# EAGLE design eLite Clock - Alpha Board (EAGLE 9.6.0)
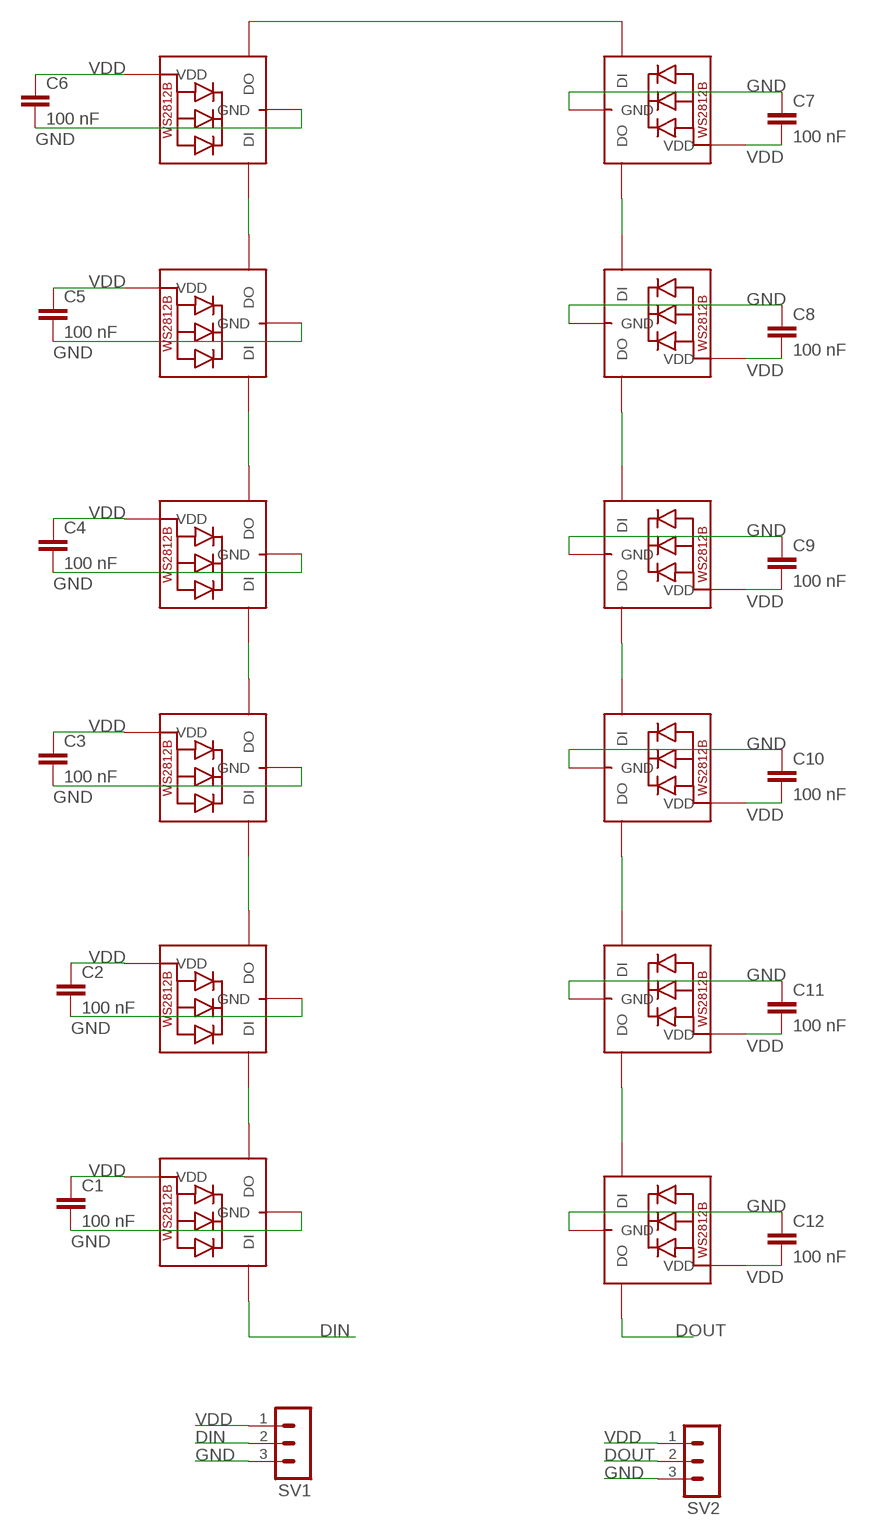
[diagram p0: schematic, sheet 1]

## Parts
C1  100 nF  C-EU025-025X050  [C025-025X050]
C2  100 nF  C-EU025-025X050  [C025-025X050]
C3  100 nF  C-EU025-025X050  [C025-025X050]
C4  100 nF  C-EU025-025X050  [C025-025X050]
C5  100 nF  C-EU025-025X050  [C025-025X050]
C6  100 nF  C-EU025-025X050  [C025-025X050]
C7  100 nF  C-EU025-025X050  [C025-025X050]
C8  100 nF  C-EU025-025X050  [C025-025X050]
C9  100 nF  C-EU025-025X050  [C025-025X050]
C10  100 nF  C-EU025-025X050  [C025-025X050]
C11  100 nF  C-EU025-025X050  [C025-025X050]
C12  100 nF  C-EU025-025X050  [C025-025X050]
LED1  WS2812B_5050W  [WS2812B-WIDE]
LED2  WS2812B_5050W  [WS2812B-WIDE]
LED3  WS2812B_5050W  [WS2812B-WIDE]
LED4  WS2812B_5050W  [WS2812B-WIDE]
LED5  WS2812B_5050W  [WS2812B-WIDE]
LED6  WS2812B_5050W  [WS2812B-WIDE]
LED7  WS2812B_5050W  [WS2812B-WIDE]
LED8  WS2812B_5050W  [WS2812B-WIDE]
LED9  WS2812B_5050W  [WS2812B-WIDE]
LED10  WS2812B_5050W  [WS2812B-WIDE]
LED11  WS2812B_5050W  [WS2812B-WIDE]
LED12  WS2812B_5050W  [WS2812B-WIDE]
SV1  MA03-1  [MA03-1]
SV2  MA03-1  [MA03-1]

## Nets
DIN: LED1.4-DIN(DI) SV1.2
DOUT: LED12.2-DOUT(DO) SV2.2
GND: C1.2 C2.2 C3.2 C4.2 C5.2 C6.2 C7.1 C8.1 C9.1 C10.1 C11.1 C12.1 LED1.3-GND(GND) LED2.3-GND(GND) LED3.3-GND(GND) LED4.3-GND(GND) LED5.3-GND(GND) LED6.3-GND(GND) LED7.3-GND(GND) LED8.3-GND(GND) LED9.3-GND(GND) LED10.3-GND(GND) LED11.3-GND(GND) LED12.3-GND(GND) SV1.3 SV2.3
N$1: LED1.2-DOUT(DO) LED2.4-DIN(DI)
N$2: LED2.2-DOUT(DO) LED3.4-DIN(DI)
N$3: LED3.2-DOUT(DO) LED4.4-DIN(DI)
N$4: LED4.2-DOUT(DO) LED5.4-DIN(DI)
N$5: LED5.2-DOUT(DO) LED6.4-DIN(DI)
N$6: LED6.2-DOUT(DO) LED7.4-DIN(DI)
N$14: LED7.2-DOUT(DO) LED8.4-DIN(DI)
N$15: LED8.2-DOUT(DO) LED9.4-DIN(DI)
N$16: LED9.2-DOUT(DO) LED10.4-DIN(DI)
N$17: LED10.2-DOUT(DO) LED11.4-DIN(DI)
N$18: LED11.2-DOUT(DO) LED12.4-DIN(DI)
VDD: C1.1 C2.1 C3.1 C4.1 C5.1 C6.1 C7.2 C8.2 C9.2 C10.2 C11.2 C12.2 LED1.1-VDD(VDD) LED2.1-VDD(VDD) LED3.1-VDD(VDD) LED4.1-VDD(VDD) LED5.1-VDD(VDD) LED6.1-VDD(VDD) LED7.1-VDD(VDD) LED8.1-VDD(VDD) LED9.1-VDD(VDD) LED10.1-VDD(VDD) LED11.1-VDD(VDD) LED12.1-VDD(VDD) SV1.1 SV2.1

## Library data of the parts
C1-C12 = rcl:C-EU: CAPACITOR, European symbol; SPICEPREFIX: C
LED1-LED12 = WS2812B-WIDE:WS2812B
SV1 SV2 = con-lstb:MA03-1: PIN HEADER; OC_FARNELL: unknown; OC_NEWARK: unknown

## Board
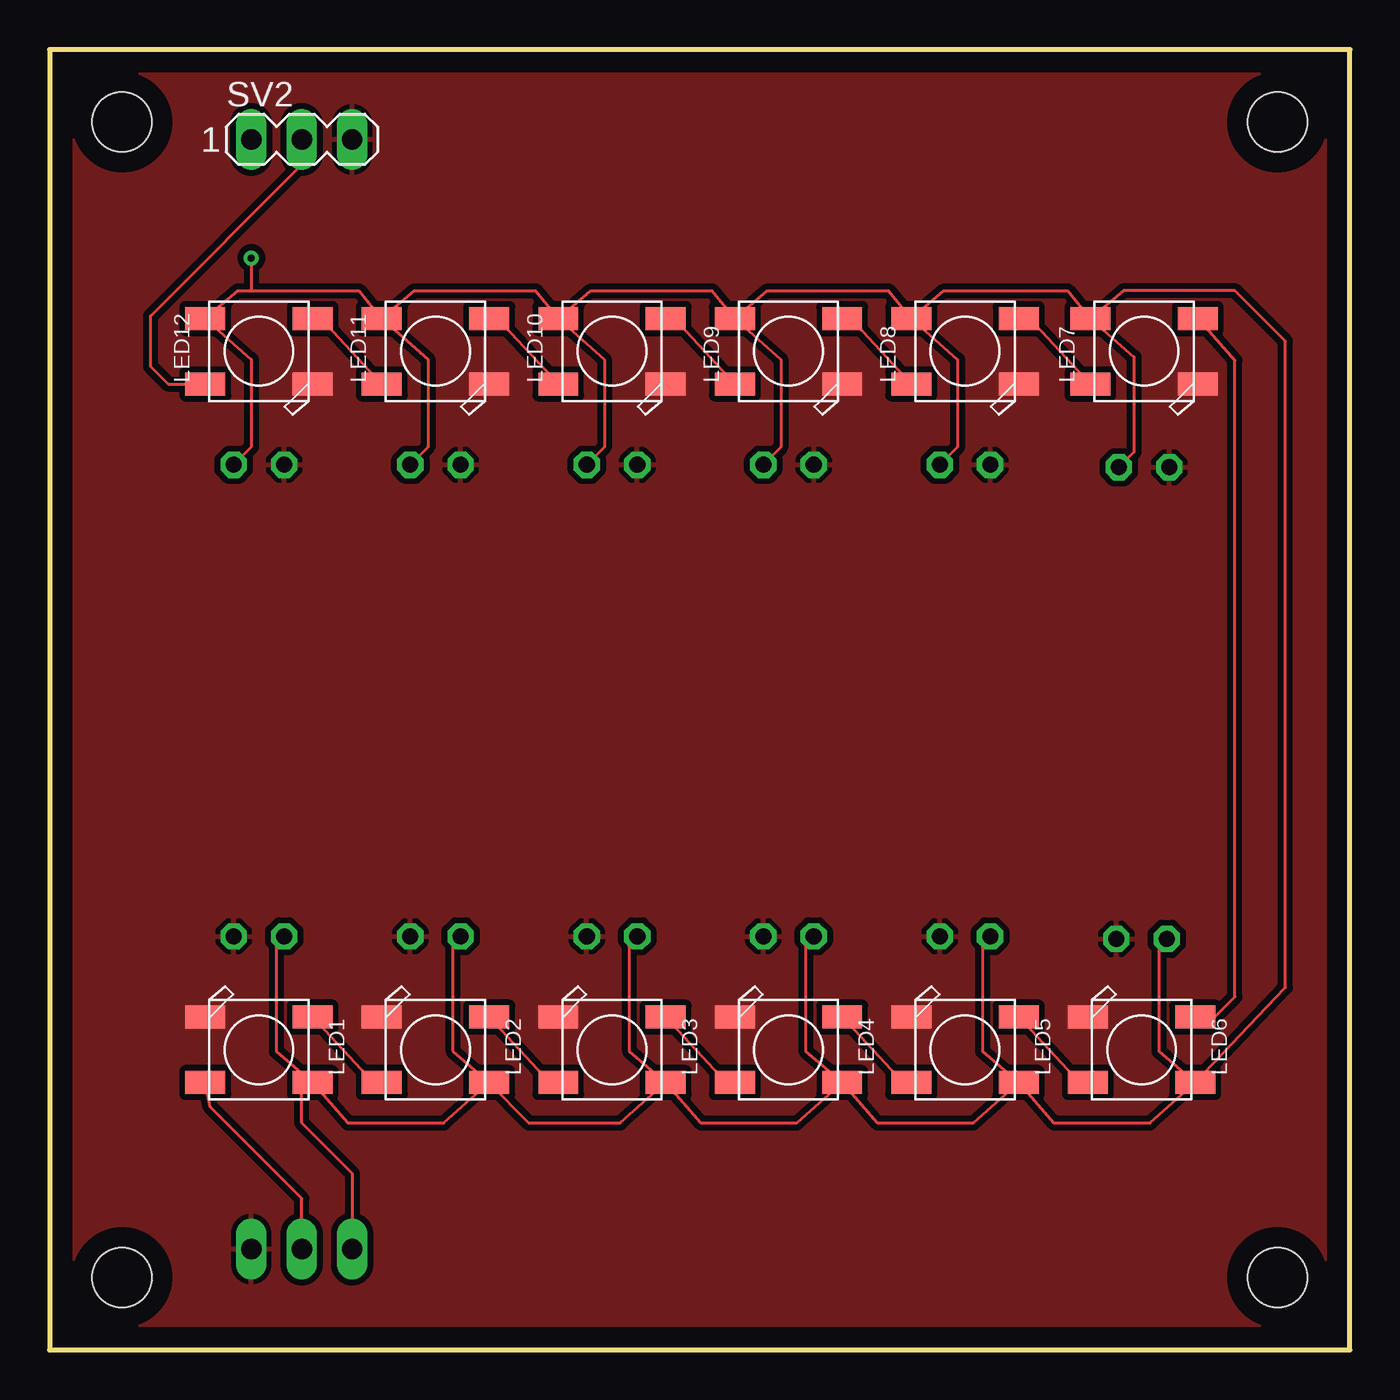
[diagram p1: board, top side]
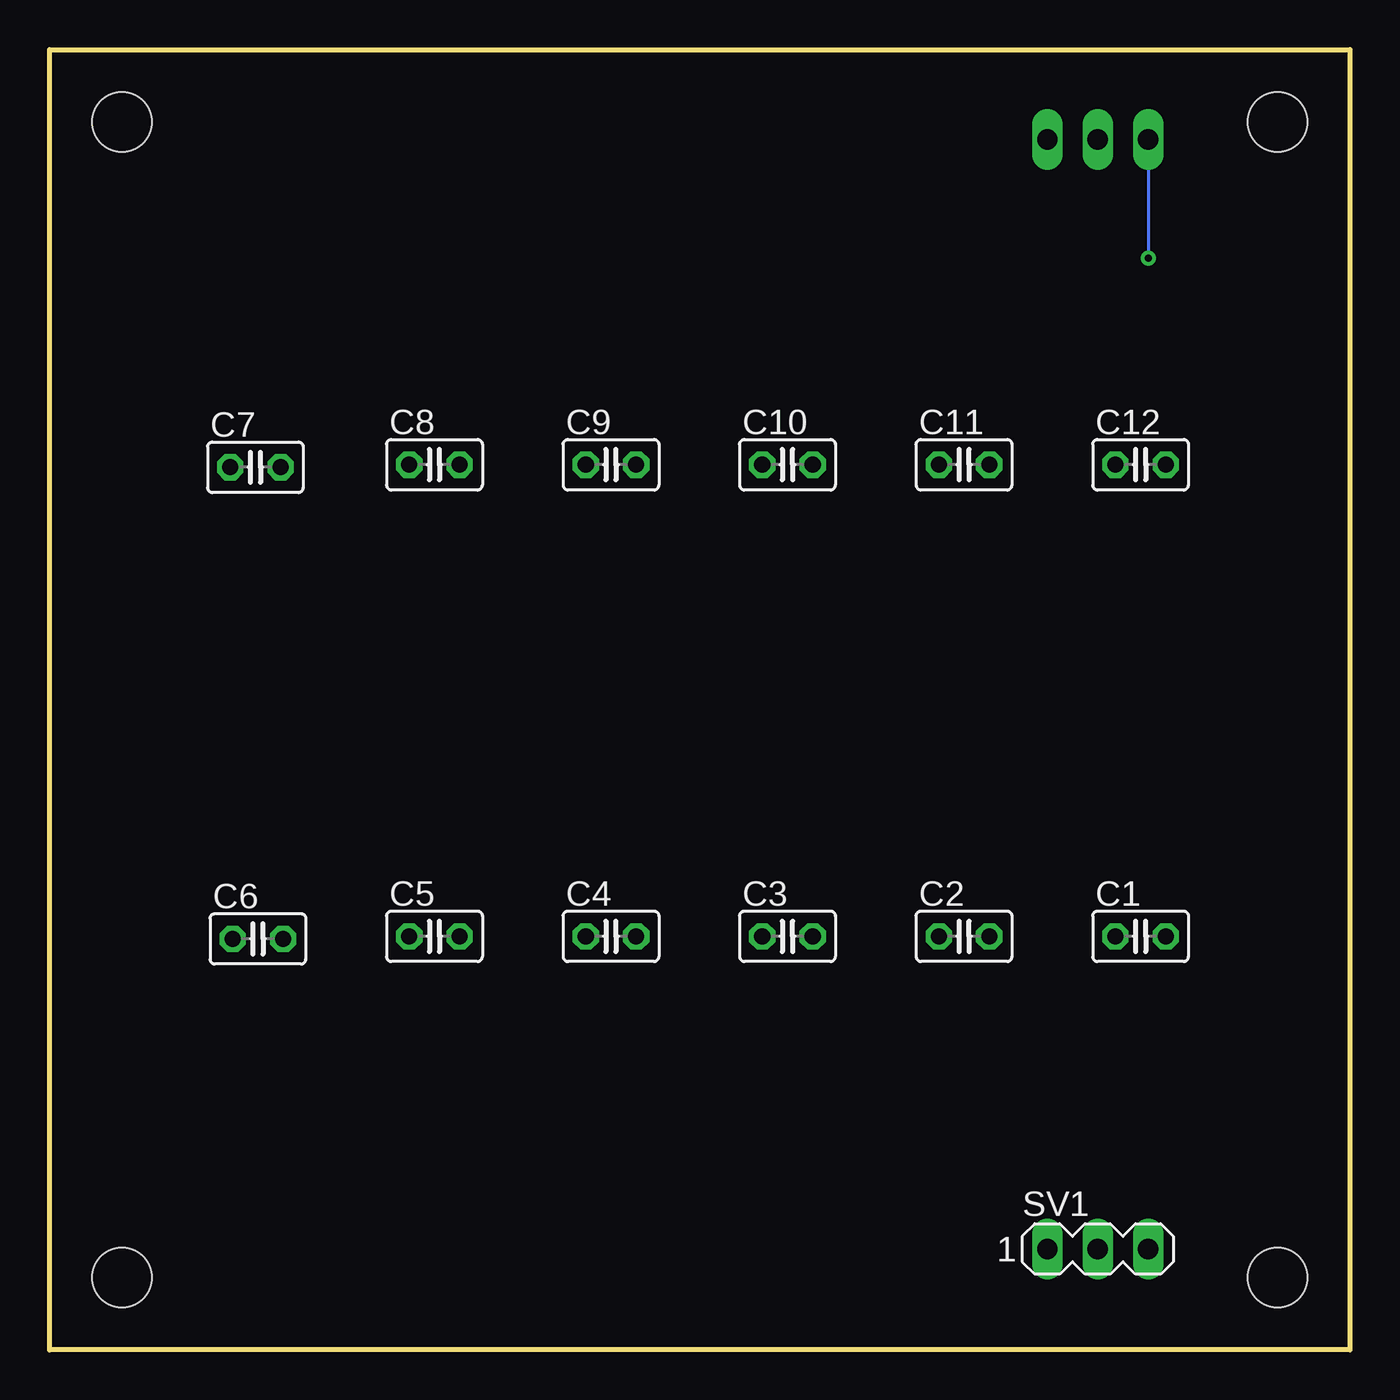
[diagram p2: board, bottom side, seen from below]

Size 65.48 x 65.48 mm. Coordinates in mm from the lower left corner, seen from the top.
Outline: 0,0 65.48,0 65.48,65.48 0,65.48 0,0
Copper layers (1*16): Top 0.035mm / dielectric 1.5mm / Bottom 0.035mm
Design rules "default": minimum track width 6mil, minimum drill 0.35mm, track to track 6mil, track to pad 6mil, pad to pad 6mil, via to via 6mil, smd to smd 6mil, copper to edge 40mil, drill to drill 6mil, minimum pad ring 10mil, minimum via ring 8mil, stop-mask expansion 4mil, vias tented up to drill 0mil, thermal gap 10mil
Holes 3 mm at 3.65,3.65 3.65,61.83 61.83,3.65 61.83,61.83

### Footprints (pad centres in the part's own frame; a part is rotated, then mirrored left to right if it is on the bottom)
C025-025X050 = drill 0.813 octagon: 1 -1.27,0; 2 1.27,0
WS2812B-WIDE = smd 2.008 x 1.154: 1-VDD 2.704,-1.65; 2-DOUT 2.704,1.65; 3-GND -2.704,1.65; 4-DIN -2.704,-1.65
MA03-1 = drill 1.016 long: 1 -2.54,0; 2 0,0; 3 2.54,0

### Placement (x,y rotation side)
C1  10.54,20.83 0 bottom
C2  19.43,20.83 0 bottom
C3  28.32,20.83 0 bottom
C4  37.21,20.83 0 bottom
C5  46.1,20.83 0 bottom
C6  54.99,20.7 0 bottom
C7  55.12,44.45 0 bottom
C8  46.1,44.58 0 bottom
C9  37.21,44.58 0 bottom
C10  28.32,44.58 0 bottom
C11  19.43,44.58 0 bottom
C12  10.54,44.58 0 bottom
LED1  10.54,15.11 0 top
LED2  19.43,15.11 0 top
LED3  28.32,15.11 0 top
LED4  37.21,15.11 0 top
LED5  46.1,15.11 0 top
LED6  54.99,15.11 0 top
LED7  55.12,50.29 180 top
LED8  46.1,50.29 180 top
LED9  37.21,50.29 180 top
LED10  28.32,50.29 180 top
LED11  19.43,50.29 180 top
LED12  10.54,50.29 180 top
SV1  12.7,5.08 0 bottom
SV2  12.7,60.96 0 top

### Tracks (layer width: path | path; a pad name or v marks a point on that pad's centre or on a via)
DIN
  Top 0.152: LED1.4-DIN 8.09,12.23 12.7,7.62 SV1.2
DOUT
  Top 0.152: LED12.2-DOUT 5.97,48.64 5.08,49.53 5.08,52.07 12.7,59.69 SV2.2
GND
  Top 0.152: 7.87,16.76 LED1.3-GND
  pour Top (isolate 0.305): 0,0 0,66.04 64.77,66.04 66.04,66.04 66.04,0
N$1
  Top 0.152: LED1.2-DOUT 16.29,13.46 LED2.4-DIN
N$2
  Top 0.152: LED2.2-DOUT 25.18,13.46 LED3.4-DIN
N$3
  Top 0.152: LED3.2-DOUT 34.07,13.46 LED4.4-DIN
N$4
  Top 0.152: LED4.2-DOUT 42.96,13.46 LED5.4-DIN
N$5
  Top 0.152: LED5.2-DOUT 51.85,13.46 LED6.4-DIN
N$6
  Top 0.152: LED6.2-DOUT 58.67,16.76 59.69,17.78 59.69,49.82 LED7.4-DIN
N$14
  Top 0.152: LED7.2-DOUT 49.37,51.94 LED8.4-DIN
N$15
  Top 0.152: LED8.2-DOUT 40.35,51.94 LED9.4-DIN
N$16
  Top 0.152: LED9.2-DOUT 31.46,51.94 LED10.4-DIN
N$17
  Top 0.152: LED10.2-DOUT 22.57,51.94 LED11.4-DIN
N$18
  Top 0.152: LED11.2-DOUT 13.68,51.94 LED12.4-DIN
VDD  (via drill 0.35)
  Top 0.152: LED1.1-VDD 12.7,13.17 12.7,11.43 15.24,8.89 SV1.1 | LED11.1-VDD 15.58,53.34 10.16,53.34 | 10.16,53.34 9.49,53.34 LED12.1-VDD 10.16,49.87 10.16,45.47 C12.2 | LED11.1-VDD 18.38,53.34 24.47,53.34 LED10.1-VDD | LED10.1-VDD 27.27,53.34 33.36,53.34 LED9.1-VDD | LED9.1-VDD 36.16,53.34 42.25,53.34 LED8.1-VDD | LED8.1-VDD 45.05,53.34 51.27,53.34 LED7.1-VDD | LED1.1-VDD 15.02,11.43 19.85,11.43 LED2.1-VDD | LED2.1-VDD 22.1,13.46 24.13,11.43 28.74,11.43 LED3.1-VDD | LED3.1-VDD 32.8,11.43 37.63,11.43 LED4.1-VDD | LED4.1-VDD 41.69,11.43 46.52,11.43 LED5.1-VDD | LED5.1-VDD 50.58,11.43 55.41,11.43 LED6.1-VDD | LED4.1-VDD 38.1,15.02 38.1,20.45 C4.1 | LED3.1-VDD 29.21,15.02 29.21,20.45 C3.1 | LED2.1-VDD 20.32,15.02 20.32,20.45 C2.1 | LED1.1-VDD 11.43,15.02 11.43,20.45 C1.1 | LED5.1-VDD 46.99,15.02 46.99,20.45 C5.1 | LED6.1-VDD 55.88,15.02 55.88,20.32 C6.1 | LED7.1-VDD 54.61,50 54.61,45.21 C7.2 | LED8.1-VDD 45.72,49.87 45.72,45.47 C8.2 | LED9.1-VDD 36.83,49.87 36.83,45.47 C9.2 | LED10.1-VDD 27.94,49.87 27.94,45.47 C10.2 | LED11.1-VDD 19.05,49.87 19.05,45.47 C11.2 | LED6.1-VDD 62.23,18.25 62.23,50.8 59.69,53.34 54.07,53.34 LED7.1-VDD | v10.16,54.99 10.16,53.34
  Bottom 0.152: SV2.1 10.16,55.24 10.03,55.12 v10.16,54.99